# Altium schematic sheet PMOD-Connecteur.SchDoc: Connecteurs - PMOD Interface
size Letter; ApprovedBy: APPROUVÉ PAR; Organization: Cegep Limoilou; Address1: 1300, 8e Avenue; Address2: Québec, QC; Address3: Canada; Address4: G1J 5L5; SheetNumber: 4; SheetTotal: 7
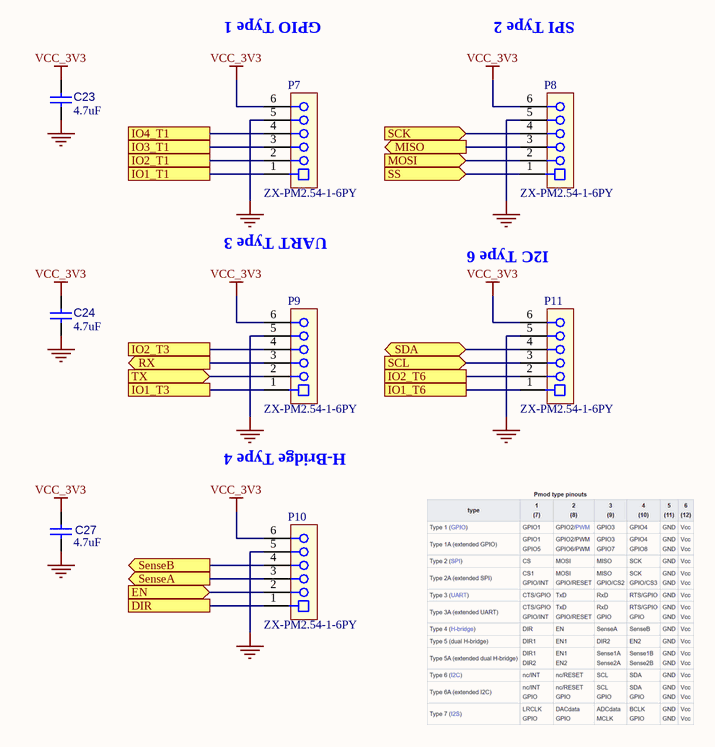
[diagram p0: PMOD-Connecteur.SchDoc]

## Parts
C23  value 4.7uF  [C_2012[0805]]  (hidden comment: Cap 4.7uF 0805)
C24  value 4.7uF  [C_2012[0805]]  (hidden comment: Cap 4.7uF 0805)
C27  value 4.7uF  [C_2012[0805]]  (hidden comment: Cap 4.7uF 0805)
P7  ZX-PM2.54-1-6PY  [CONN_SKT_01X06_100MIL]
P8  ZX-PM2.54-1-6PY  [CONN_SKT_01X06_100MIL]
P9  ZX-PM2.54-1-6PY  [CONN_SKT_01X06_100MIL]
P10  ZX-PM2.54-1-6PY  [CONN_SKT_01X06_100MIL]
P11  ZX-PM2.54-1-6PY  [CONN_SKT_01X06_100MIL]

## Ports
DIR (see PCB-Support-STM32F407[3C]), EN (in, see PCB-Support-STM32F407[3C]), IO1_T1 (see PCB-Support-STM32F407[3B]), IO1_T3 (see PCB-Support-STM32F407[3B]), IO1_T6 (see PCB-Support-STM32F407[3B]), IO2_T1 (see PCB-Support-STM32F407[3B]), IO2_T3 (see PCB-Support-STM32F407[3B]), IO2_T6 (see PCB-Support-STM32F407[3B]), IO3_T1 (see PCB-Support-STM32F407[3B]), IO4_T1 (see PCB-Support-STM32F407[3B]), MISO (out, see PCB-Support-STM32F407[3B]), MOSI (in, see PCB-Support-STM32F407[3B]), RX (out, see PCB-Support-STM32F407[3B]), SCK (in, see PCB-Support-STM32F407[3B]), SCL (in, see PCB-Support-STM32F407[3B], MikroBus-Connecteur[3C]), SDA (bidir, see PCB-Support-STM32F407[3B], MikroBus-Connecteur[3C]), SenseA (out, see PCB-Support-STM32F407[3C]), SenseB (out, see PCB-Support-STM32F407[3C]), SS (in, see PCB-Support-STM32F407[3B]), TX (in, see PCB-Support-STM32F407[3B])

## Nets
GND: C23.1 C24.1 C27.1 P7.5 P8.5 P9.5 P10.5 P11.5
VCC_3V3: C23.2 C24.2 C27.2 P7.6 P8.6 P9.6 P10.6 P11.6
DIR: P10.1 ; port DIR
EN: P10.2 ; port EN
IO1_T1: P7.1 ; port IO1_T1
IO1_T3: P9.1 ; port IO1_T3
IO1_T6: P11.1 ; port IO1_T6
IO2_T1: P7.2 ; port IO2_T1
IO2_T3: P9.4 ; port IO2_T3
IO2_T6: P11.2 ; port IO2_T6
IO3_T1: P7.3 ; port IO3_T1
IO4_T1: P7.4 ; port IO4_T1
MISO: P8.3 ; port MISO
MOSI: P8.2 ; port MOSI
RX: P9.3 ; port RX
SCK: P8.4 ; port SCK
SCL: P11.3 ; port SCL
SDA: P11.4 ; port SDA
SenseA: P10.3 ; port SenseA
SenseB: P10.4 ; port SenseB
SS: P8.1 ; port SS
TX: P9.2 ; port TX

## Notes on the sheet
- GPIO Type 1
- SPI Type 2
- UART Type 3
- I2C Type 6
- H-Bridge Type 4
- Titre :
- Conception :
- Date :
- Approbation :
- Heure :
- Révision :
- Feuille
- de
- Fichier :

## Library data of the parts
C23 C24 C27 = CAP003: Capacitor type 1; Manufacturer 1: Taiyo Yuden; Manufacturer Part Number 1: TMK212AB7475KG-T; LibRef: CAP003; CEGEP: KCOND02SM; Tolerance: 10%; Rated Voltage: 25V; Dielectric: X7R; Supplier 1: LCSC; Supplier Part Number 1: C163186; Mounting Technology: SMT
P7-P11 = CONN-100MIL-SKT-01X06: CONN SOCKET 6pos 100mils; Manufacturer 1: Megastar; Mounting Technology: TH; Manufacturer Part Number 1: ZX-PM2.54-1-6PY; Supplier 1: LCSC; Supplier Part Number 1: C7499326